# Altium schematic sheet Sheet2.SchDoc
size A2; SheetNumber: 5; SheetTotal: 5
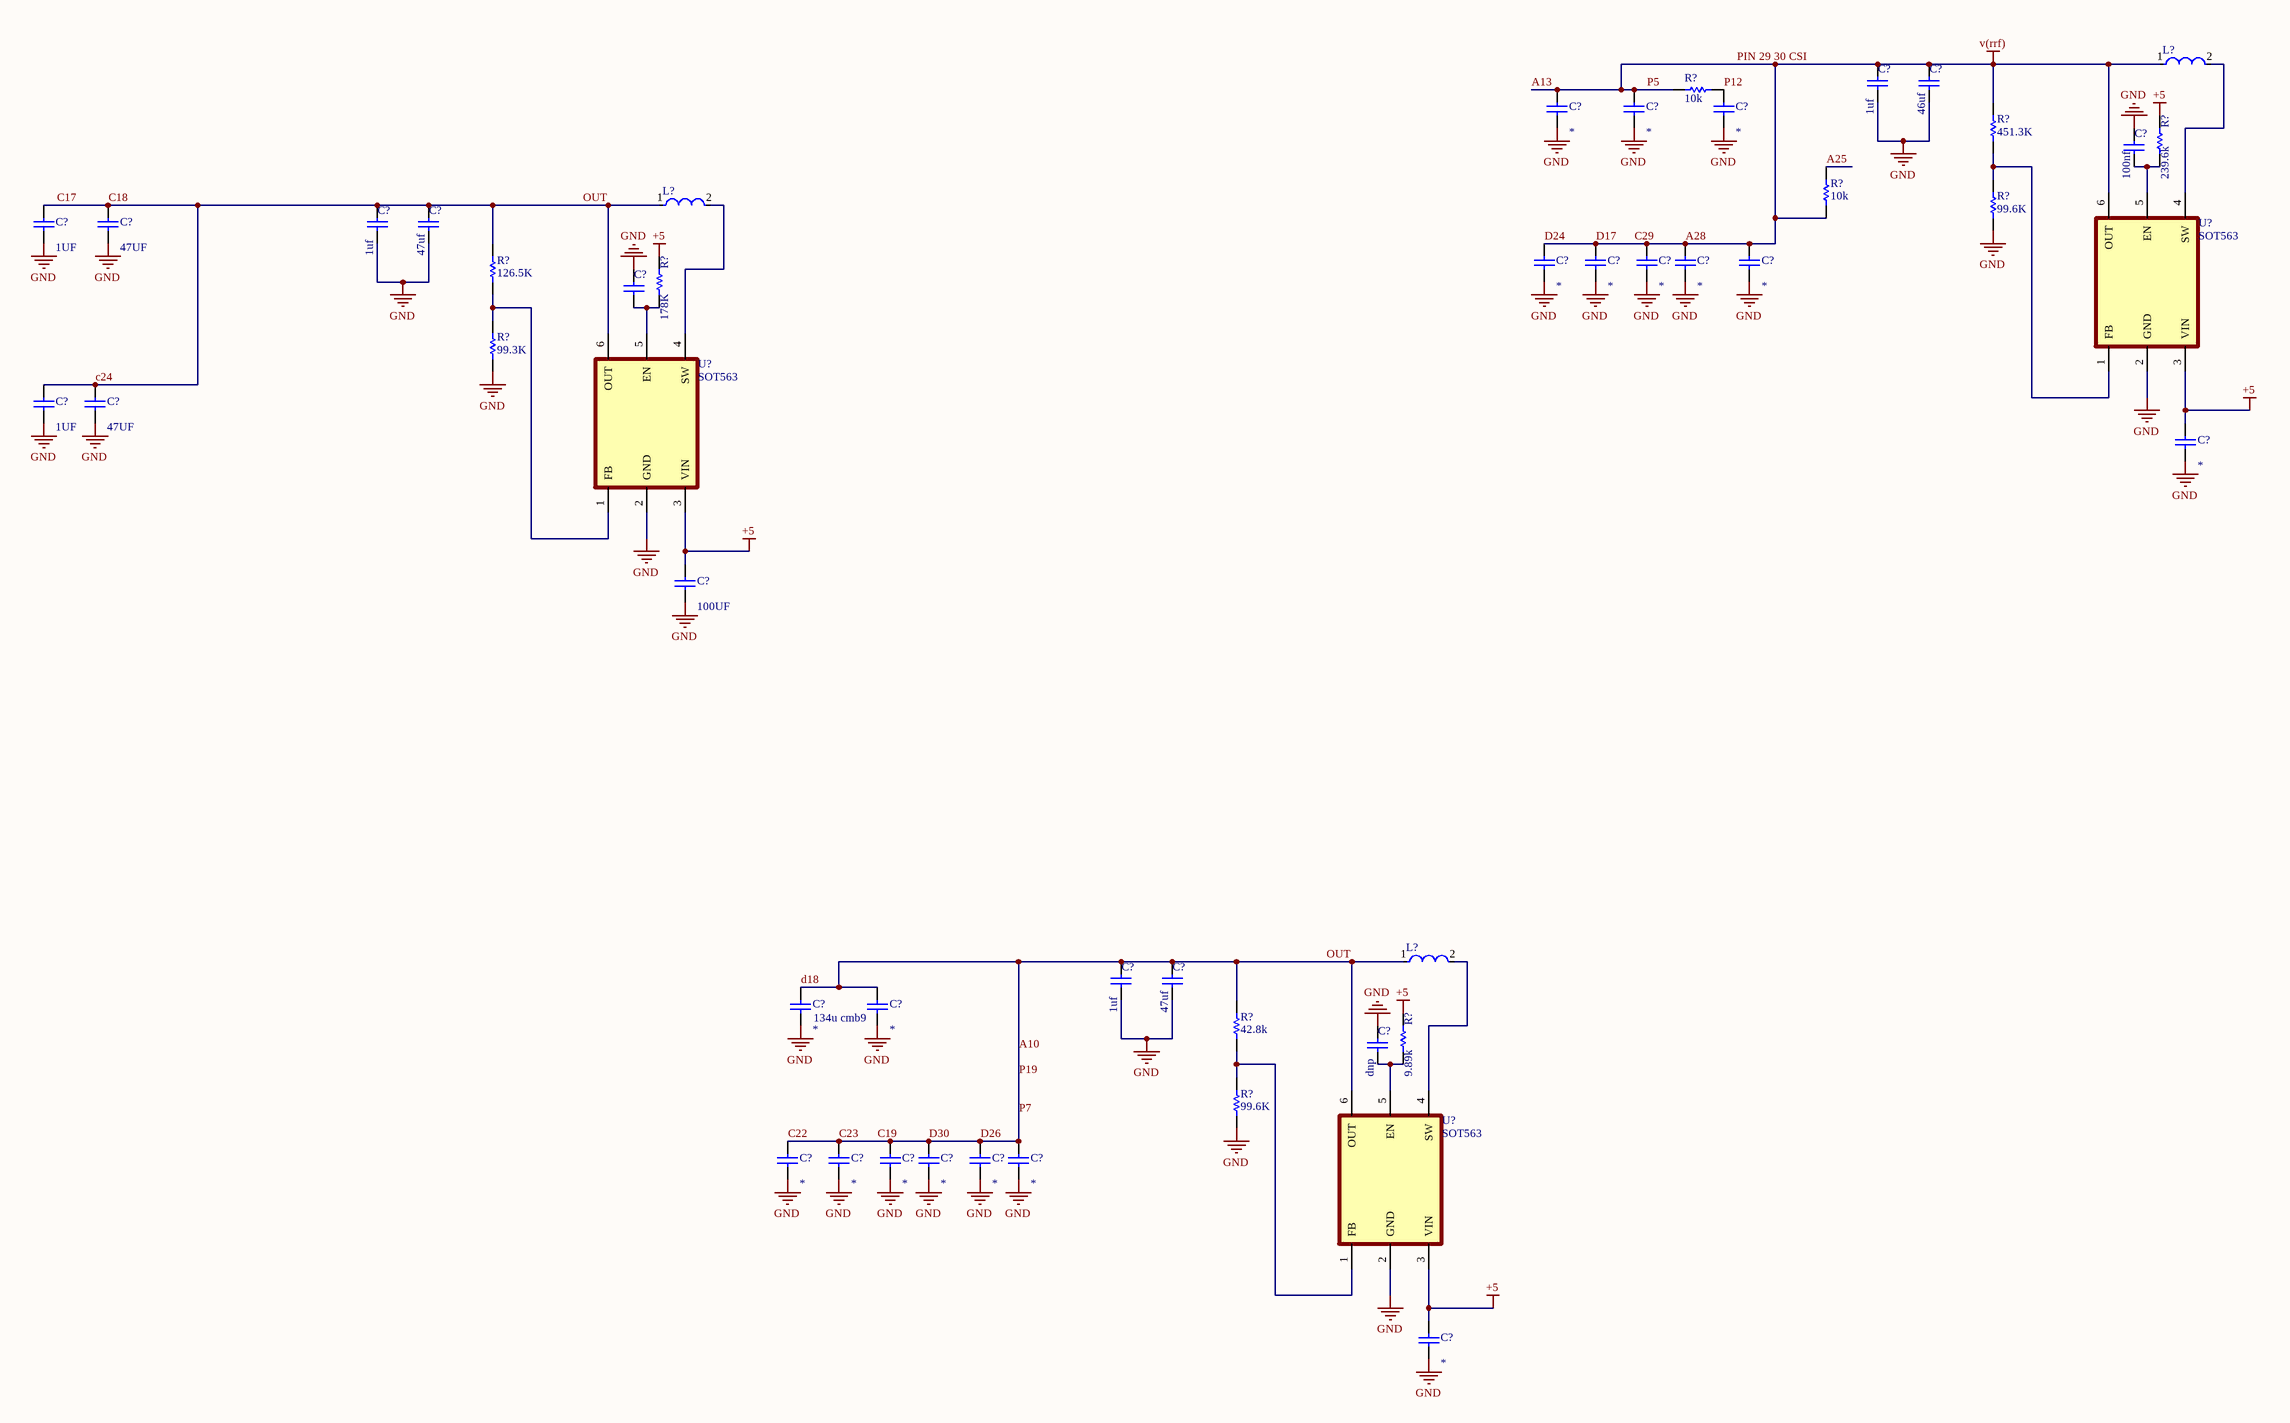
[diagram p0: Sheet2.SchDoc]

## Parts
(Parts that share a designator on the sheet are numbered #1, #2 ... from top to bottom, then left to right.)
C?#1  1uf  [CAPC1005X56X25LL10T15]
C?#2  46uf  [CAPC1005X56X25LL10T15]
C?#3  *  [CAPC1005X56X25LL10T15]
C?#4  *  [CAPC1005X56X25LL10T15]
C?#5  *  [CAPC1005X56X25LL10T15]
C?#6  100nf  [CAPC1005X56X25LL10T15]
C?#7  1UF  [CAPC1005X56X25LL10T15]
C?#8  47UF  [CAPC1005X56X25LL10T15]
C?#9  1uf  [CAPC1005X56X25LL10T15]
C?#10  47uf  [CAPC1005X56X25LL10T15]
C?#11  *  [CAPC1005X56X25LL10T15]
C?#12  *  [CAPC1005X56X25LL10T15]
C?#13  *  [CAPC1005X56X25LL10T15]
C?#14  *  [CAPC1005X56X25LL10T15]
C?#15  *  [CAPC1005X56X25LL10T15]
C?#16  (no value)  [CAPC1005X56X25LL10T15]
C?#17  1UF  [CAPC1005X56X25LL10T15]
C?#18  47UF  [CAPC1005X56X25LL10T15]
C?#19  *  [CAPC1005X56X25LL10T15]
C?#20  100UF  [CAPC1005X56X25LL10T15]
C?#21  1uf  [CAPC1005X56X25LL10T15]
C?#22  47uf  [CAPC1005X56X25LL10T15]
C?#23  *  [CAPC1005X56X25LL10T15]
C?#24  *  [CAPC1005X56X25LL10T15]
C?#25  dnp  [CAPC1005X56X25LL10T15]
C?#26  *  [CAPC1005X56X25LL10T15]
C?#27  *  [CAPC1005X56X25LL10T15]
C?#28  *  [CAPC1005X56X25LL10T15]
C?#29  *  [CAPC1005X56X25LL10T15]
C?#30  *  [CAPC1005X56X25LL10T15]
C?#31  *  [CAPC1005X56X25LL10T15]
C?#32  *  [CAPC1005X56X25LL10T15]
L?#1  (no value)  [FP-LQH31CN_03-MFG]
L?#2  (no value)  [FP-LQH31CN_03-MFG]
L?#3  (no value)  [FP-LQH31CN_03-MFG]
R?#1  10k  [RESC1005X40X25LL05T10]
R?#2  451.3K  [RESC1005X40X25LL05T10]
R?#3  239.6k  [RESC1005X40X25LL05T10]
R?#4  10k  [RESC1005X40X25LL05T10]
R?#5  99.6K  [RESC1005X40X25LL05T10]
R?#6  126.5K  [RESC1005X40X25LL05T10]
R?#7  178K  [RESC1005X40X25LL05T10]
R?#8  99.3K  [RESC1005X40X25LL05T10]
R?#9  42.8k  [RESC1005X40X25LL05T10]
R?#10  9.89k  [RESC1005X40X25LL05T10]
R?#11  99.6K  [RESC1005X40X25LL05T10]
U?#1  SOT563
U?#2  SOT563
U?#3  SOT563

## Nets
+5: C?#19.2 C?#20.2 C?#32.2 R?#3.2 R?#7.2 R?#10.2 U?#1.3(VIN) U?#2.3(VIN) U?#3.3(VIN)
A13: C?#1.2 C?#2.2 C?#3.2 C?#4.2 C?#11.2 C?#12.2 C?#13.2 C?#14.2 C?#15.2 L?#1.1 R?#1.2 R?#2.2 R?#4.1 U?#1.6(OUT)  [also labelled A28, C29, D17, D24, P5, PIN 29 30 CSI , v(rrf)]
GND: C?#1.1 C?#2.1 C?#3.1 C?#4.1 C?#5.1 C?#6.2 C?#7.1 C?#8.1 C?#9.1 C?#10.1 C?#11.1 C?#12.1 C?#13.1 C?#14.1 C?#15.1 C?#16.2 C?#17.1 C?#18.1 C?#19.1 C?#20.1 C?#21.1 C?#22.1 C?#23.1 C?#24.1 C?#25.2 C?#26.1 C?#27.1 C?#28.1 C?#29.1 C?#30.1 C?#31.1 C?#32.1 R?#5.1 R?#8.1 R?#11.1 U?#1.2(GND) U?#2.2(GND) U?#3.2(GND)
A10: C?#7.2 C?#8.2 C?#9.2 C?#10.2 C?#17.2 C?#18.2 C?#21.2 C?#22.2 C?#23.2 C?#24.2 C?#26.2 C?#27.2 C?#28.2 C?#29.2 C?#30.2 C?#31.2 L?#2.1 L?#3.1 R?#6.2 R?#9.2 U?#2.6(OUT) U?#3.6(OUT)  [also labelled C17, C18, C19, C22, C23, c24, d18, D26, D30, OUT, P19, P7]
A25: R?#4.2
P12: C?#5.2 R?#1.1
NetC?#6_1: C?#6.1 R?#3.1 U?#1.5(EN)
NetC?#16_1: C?#16.1 R?#7.1 U?#2.5(EN)
NetC?#25_1: C?#25.1 R?#10.1 U?#3.5(EN)
NetL?#1_2: L?#1.2 U?#1.4(SW)
NetL?#2_2: L?#2.2 U?#2.4(SW)
NetL?#3_2: L?#3.2 U?#3.4(SW)
NetR?#2_1: R?#2.1 R?#5.2 U?#1.1(FB)
NetR?#6_1: R?#6.1 R?#8.2 U?#2.1(FB)
NetR?#9_1: R?#9.1 R?#11.2 U?#3.1(FB)

## Notes on the sheet
- (near C?#24) 134u cmb9

## Library data of the parts
C?#1-C?#32 = CMP-2008-02962-1
  C?#1 C?#9 C?#21: VALUE: 1uf
  C?#2: VALUE: 46uf
  C?#3-C?#5 C?#11-C?#15 C?#19 C?#23 C?#24 C?#26-C?#32: VALUE: *
  C?#6: VALUE: 100nf
  C?#7 C?#17: VALUE: 1UF
  C?#8 C?#18: VALUE: 47UF
  C?#10 C?#22: VALUE: 47uf
  C?#20: VALUE: 100UF
  C?#25: VALUE: dnp
L?#1-L?#3 = CMP-06042-002477-1
R?#1-R?#11 = CMP-2002-07161-1
  R?#1 R?#4: VALUE: 10k
  R?#2: VALUE: 451.3K
  R?#3: VALUE: 239.6k
  R?#5 R?#11: VALUE: 99.6K
  R?#6: VALUE: 126.5K
  R?#7: VALUE: 178K
  R?#8: VALUE: 99.3K
  R?#9: VALUE: 42.8k
  R?#10: VALUE: 9.89k